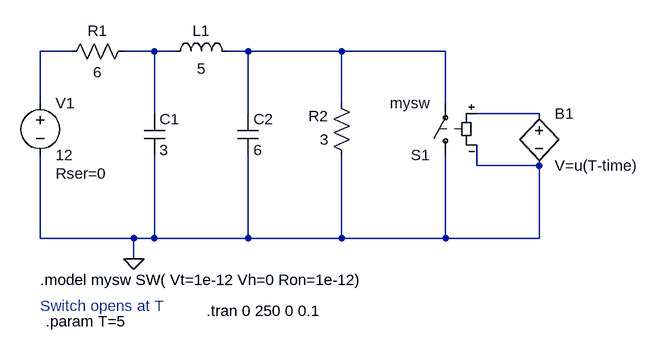
[diagram p0: schematic Problem_1.asc]
Problem_1.asc, the LTspice schematic file:
Version 4.1
SHEET 1 1028 680
WIRE 96 192 48 192
WIRE 224 192 176 192
WIRE 256 192 224 192
WIRE 368 192 336 192
WIRE 512 192 368 192
WIRE 672 192 512 192
WIRE 48 272 48 192
WIRE 512 272 512 192
WIRE 672 272 672 192
WIRE 224 288 224 192
WIRE 368 288 368 192
WIRE 816 288 720 288
WIRE 720 368 720 336
WIRE 816 368 720 368
WIRE 48 480 48 352
WIRE 192 480 48 480
WIRE 224 480 224 352
WIRE 224 480 192 480
WIRE 368 480 368 352
WIRE 368 480 224 480
WIRE 512 480 512 352
WIRE 512 480 368 480
WIRE 672 480 672 352
WIRE 672 480 512 480
WIRE 816 480 816 368
WIRE 816 480 672 480
WIRE 192 512 192 480
FLAG 192 512 0
SYMBOL sw 672 368 R180
SYMATTR InstName S1
SYMATTR Value mysw
SYMBOL bv 816 272 R0
SYMATTR InstName B1
SYMATTR Value V=u(T-time)
SYMBOL voltage 48 256 R0
WINDOW 123 0 0 Left 0
WINDOW 39 24 124 Left 2
SYMATTR SpiceLine Rser=0
SYMATTR InstName V1
SYMATTR Value 12
SYMBOL res 80 208 R270
WINDOW 0 32 56 VTop 2
WINDOW 3 0 56 VBottom 2
SYMATTR InstName R1
SYMATTR Value 6
SYMBOL res 528 368 R180
WINDOW 0 36 76 Left 2
WINDOW 3 36 40 Left 2
SYMATTR InstName R2
SYMATTR Value 3
SYMBOL cap 208 288 R0
SYMATTR InstName C1
SYMATTR Value 3
SYMBOL cap 352 288 R0
SYMATTR InstName C2
SYMATTR Value 6
SYMBOL ind 240 208 R270
WINDOW 0 32 56 VTop 2
WINDOW 3 5 56 VBottom 2
SYMATTR InstName L1
SYMATTR Value 5
SYMATTR SpiceLine Rser=0
TEXT 304 592 Left 2 !.tran 0 250 0 0.1
TEXT 48 544 Left 2 !.model mysw SW( Vt=1e-12 Vh=0 Ron=1e-12)
TEXT 48 584 Left 2 ;Switch opens at T
TEXT 56 608 Left 2 !.param T=5

The netlist it stands for:
* Problem_1.asc
S1 0 N003 N004 0 mysw
B1 N004 0 V=u(T-time)
V1 N001 0 12 Rser=0
R1 N001 N002 6
R2 0 N003 3
C1 N002 0 3
C2 N003 0 6
L1 N002 N003 5 Rser=0
.tran 0 250 0 0.1
.model mysw SW( Vt=1e-12 Vh=0 Ron=1e-12)
* Switch opens at T
.param T=5
.backanno
.end